# Altium schematic sheet Sheet_2.schdoc
size 291 x 189 mm
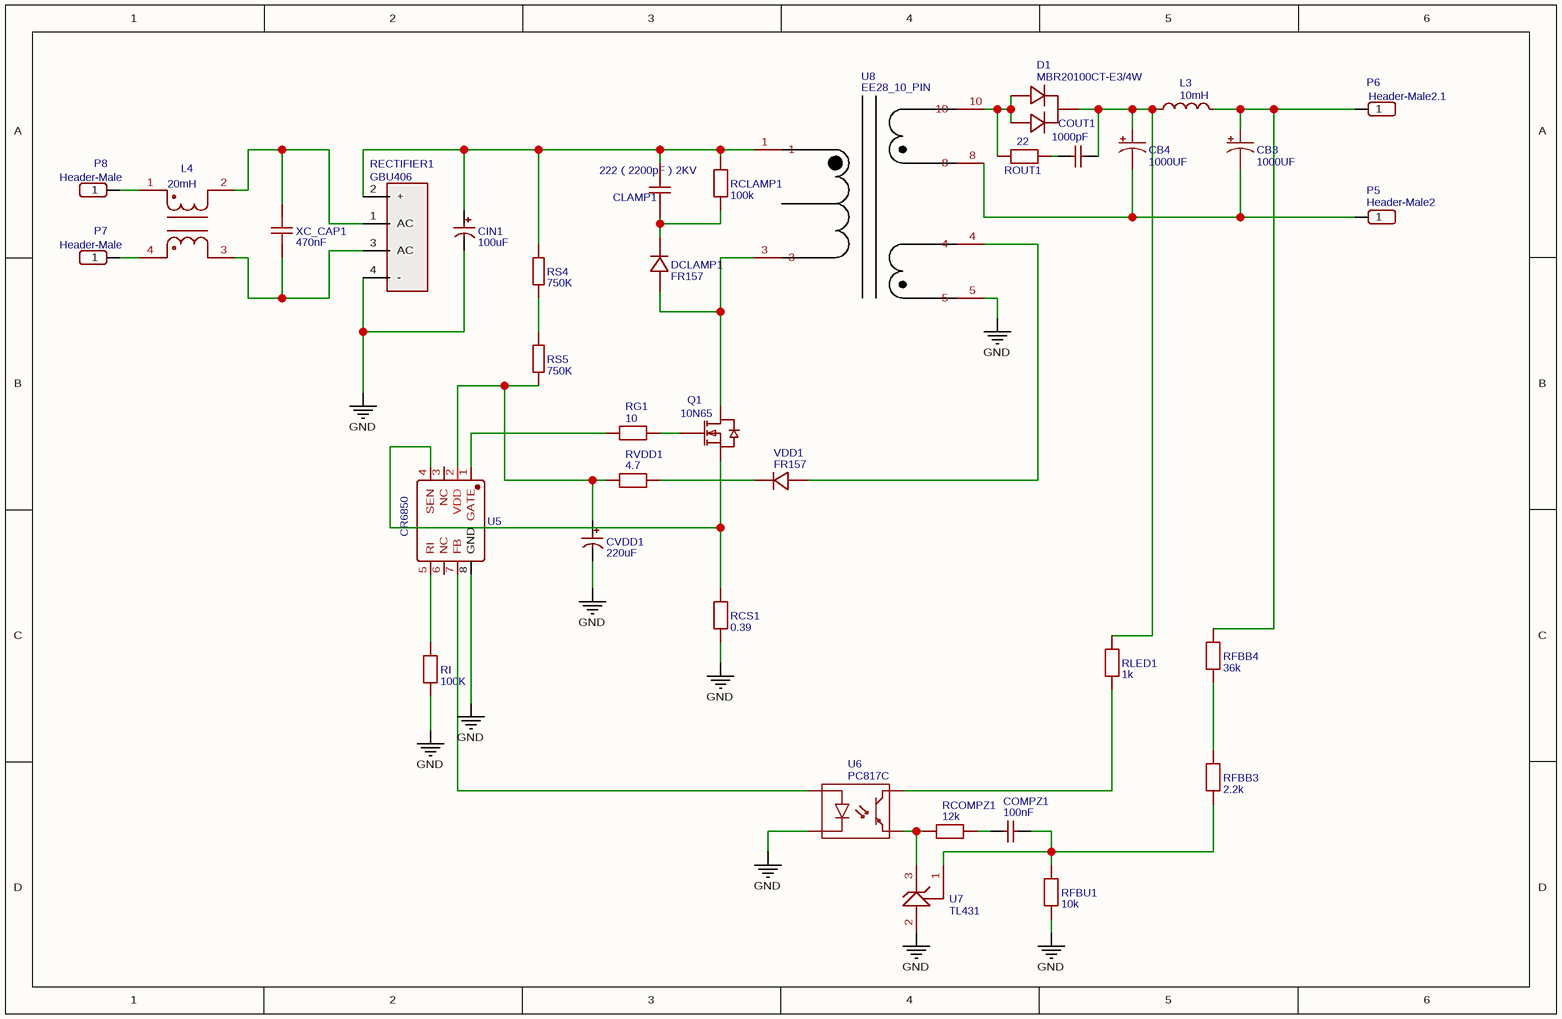
[diagram p0: Sheet_2.schdoc]

## Parts
CB3  1000UF  [CPOL-RADIAL-1000UF-25V-KIT]
CB4  1000UF  [CPOL-RADIAL-1000UF-25V-KIT]
CIN1  100uF  [CAP-TH_BD18.0-P7.50-D1.2-FD]
CLAMP1  222（2200pF）2KV  [CAP-TH_L5.0-W4.0-P5.00-D1.0-FD]
COMPZ1  100nF  [RAD-0.2]
COUT1  1000pF  [CAP-12*3-10MM]
CVDD1  220uF  [CAP-TH_BD8.0-P3.50-D1.0-FD]
D1  MBR20100CT-E3/4W  [TO-220AB(TO-220-3)]
DCLAMP1  FR157  [DO-15]
L3  10mH  [IND-TH_BD8.0-P3.00-D0.6]
L4  20mH  [FILTER-TH_4P-L17.0-W12.0-P7.00-D0.6-S8.00]
P5  Header-Male2  [HDR-1X1/2.54]
P6  Header-Male2.1  [HDR-1X1/2.54]
P7  Header-Male  [HDR-1X1/2.54]
P8  Header-Male  [HDR-1X1/2.54]
Q1  10N65  [TO-220F(TO-220IS)]
RCLAMP1  100k  [AXIAL-0.6]
RCOMPZ1  12k  [AXIAL-0.4]
RCS1  0.39  [AXIAL-0.8]
RECTIFIER1  GBU406  [BRIDGE-GBU]
RFBB3  2.2k  [AXIAL-0.4]
RFBB4  36k  [AXIAL-0.4]
RFBU1  10k  [AXIAL-0.4]
RG1  10  [AXIAL-0.3]
RI  100K  [AXIAL-0.4]
RLED1  1k  [AXIAL-0.4]
ROUT1  22  [AXIAL-0.4]
RS4  750K  [RES-TH_BD2.3-L6.5-P10.50-D0.5]
RS5  750K  [RES-TH_BD2.3-L6.5-P10.50-D0.5]
RVDD1  4.7  [AXIAL-0.4]
U5  CR6850  [DIP-8_L9.3-W6.4-P2.54-LS7.6-BL]
U6  PC817C  [DIP4]
U7  TL431  [TO-92(TO-92-3)]
U8  EE28_10_PIN  [TRANSFORMER_EE28_10PIN]
VDD1  FR157  [DO-15]
XC_CAP1  470nF  [CAP-SAFE-18.0*10.0]

## Nets
GND: CIN1.2 CVDD1.2 RCS1.1 RECTIFIER1.4(-) RFBU1.1 RI.1 U5.8(GND) U6.2(K) U7.2(ANODE) U8.5
NetCB3_+: CB3.+ L3.2 P6.1 RFBB4.2
NetCB3_-: CB3.- CB4.- P5.1 U8.8
NetCB4_+: CB4.+ COUT1.2 D1.2 L3.1 RLED1.2
NetCIN1_1: CIN1.1 CLAMP1.2 RCLAMP1.2 RECTIFIER1.2(+) RS4.2 U8.1
NetCLAMP1_1: CLAMP1.1 DCLAMP1.2(K) RCLAMP1.1
NetCOMPZ1_1: COMPZ1.1 RCOMPZ1.2
NetCOMPZ1_2: COMPZ1.2 RFBB3.1 RFBU1.2 U7.1(REF)
NetCOUT1_1: COUT1.1 ROUT1.2
NetCVDD1_1: CVDD1.1 RS5.1 RVDD1.1 U5.2(VDD)
NetD1_1: D1.1 D1.3 ROUT1.1 U8.10
NetDCLAMP1_1: DCLAMP1.1(A) Q1.2(D) U8.3
NetL4_1: L4.1 P8.1
NetL4_2: L4.2 RECTIFIER1.1(AC) XC_CAP1.1
NetL4_3: L4.3 RECTIFIER1.3(AC) XC_CAP1.2
NetL4_4: L4.4 P7.1
NetQ1_1: Q1.1(G) RG1.2
NetQ1_3: Q1.3(S) RCS1.2 U5.4(SEN)
NetRCOMPZ1_1: RCOMPZ1.1 U6.3(E) U7.3(CATHODE)
NetRFBB3_2: RFBB3.2 RFBB4.1
NetRG1_1: RG1.1 U5.1(GATE)
NetRI_2: RI.2 U5.5(RI)
NetRLED1_1: RLED1.1 U6.4(C)
NetRS4_1: RS4.1 RS5.2
NetRVDD1_2: RVDD1.2 VDD1.2(K)
NetU5_7: U5.7(FB) U6.1(A)
NetU8_4: U8.4 VDD1.1(A)

Not connected (* = marked no-connect by the designer): U5 3(NC) 6(NC)

## Library data of the parts
CB3 CB4 = 1000UF: description: CAP-08070; Contributor: SparkFun; spicePre: C
CIN1 = 100uF: BOM_Manufacturer: ValuePro; BOM_Manufacturer Part: 400V 100uF 18X30; nameAlias: Capacitance; BOM_Supplier: LCSC; BOM_Supplier Part: C2767; spicePre: C; spiceSymbolName: 400V 100uF 18X30
CLAMP1 = 222（2200pF）2KV: BOM_Manufacturer: ReliaPro; Value: 2.2nF; BOM_Supplier Part: C24926; BOM_Supplier: LCSC; BOM_Manufacturer Part: 222（2200pF）2KV; image: http://image.lceda.cn/szlcsc/C24926.jpg; spicePre: C
COMPZ1 = 100nF: BOM_Manufacturer: ReliaPro; BOM_Manufacturer Part: 104/100V 20%; nameAlias: Capacitance; BOM_Supplier: LCSC; BOM_Supplier Part: C26856; spicePre: C; spiceSymbolName: 104/100V 20%
COUT1 = 1000pF: BOM_Manufacturer: ReliaPro; BOM_Manufacturer Part: 102M 400V Y5V; nameAlias: Value; BOM_Supplier: LCSC; BOM_Supplier Part: C3704; spicePre: C; spiceSymbolName: 102M 400V Y5V
CVDD1 = 220uF: BOM_Manufacturer: ValuePro; BOM_Manufacturer Part: 220uf/35V; nameAlias: Capacitance; BOM_Supplier: LCSC; BOM_Supplier Part: C2063; spicePre: C; spiceSymbolName: 220uf/35V
D1 = MBR20100CT-E3/4W: BOM_Manufacturer: Vishay Intertech; Contributor: LCSC; BOM_Supplier: LCSC; BOM_Supplier Part: C222466; BOM_Manufacturer Part: MBR20100CT-E3/4W; spicePre: D
DCLAMP1 VDD1 = FR157: BOM_Manufacturer: MDD; BOM_Supplier: LCSC; BOM_Manufacturer Part: FR157; image: //image.lceda.cn/szlcsc/C2467.jpg; BOM_Supplier Part: C2467; spicePre: D
L3 = 10mH: BOM_Manufacturer: FH; BOM_Manufacturer Part: VLU0608-103K; nameAlias: Inductance; BOM_Supplier: LCSC; BOM_Supplier Part: C72613; spicePre: L; spiceSymbolName: VLU0608-103K
L4 = 20mH: BOM_Manufacturer: Guangdong Fenghua Advanced Tech; BOM_Manufacturer Part: UU9.8-10mH; nameAlias: Value; Contributor: LCSC; BOM_Supplier: LCSC; BOM_Supplier Part: C148474; spicePre: L; spiceSymbolName: UU9.8-10MH
P5 = Header-Male2: BOM_Manufacturer: ReliaPro; BOM_Manufacturer Part: Header-Male-2.54_1x1; BOM_Supplier: LCSC; BOM_Supplier Part: C81276; spicePre: P
P6 = Header-Male2.1: BOM_Manufacturer: ReliaPro; BOM_Manufacturer Part: Header-Male-2.54_1x1; BOM_Supplier: LCSC; BOM_Supplier Part: C81276; spicePre: P
P7 P8 = Header-Male: BOM_Manufacturer: ReliaPro; BOM_Manufacturer Part: Header-Male-2.54_1x1; BOM_Supplier: LCSC; BOM_Supplier Part: C81276; spicePre: P
Q1 = 10N65: BOM_Manufacturer: UTC; BOM_Manufacturer Part: 10N65KL-TF3-T; BOM_Supplier: LCSC; image: //image.lceda.cn/szlcsc/C74166.jpg; BOM_Supplier Part: C74166; spicePre: Q
RCLAMP1 = 100k: nameAlias: Value(Ω); spicePre: R; spiceSymbolName: Res_AXIAL-0.6(1W)_EU
RCOMPZ1 = 12k: nameAlias: Value(Ω); spicePre: R; spiceSymbolName: Res_AXIAL-0.4(1/4W)_EU
RCS1 = 0.39: nameAlias: Value(Ω); spicePre: R; spiceSymbolName: Res_AXIAL-0.8(2W)_EU
RECTIFIER1 = GBU406: BOM_Manufacturer: MDD; BOM_Manufacturer Part: GBU406 Rectifier bridge; BOM_Supplier: LCSC; image: //image.lceda.cn/szlcsc/C13432.jpg; BOM_Supplier Part: C13432; spicePre: D
RFBB3 = 2.2k: nameAlias: Value(Ω); spicePre: R; spiceSymbolName: Res_AXIAL-0.4(1/4W)_EU
RFBB4 = 36k: nameAlias: Value(Ω); spicePre: R; spiceSymbolName: Res_AXIAL-0.4(1/4W)_EU
RFBU1 = 10k: nameAlias: Value(Ω); spicePre: R; spiceSymbolName: Res_AXIAL-0.4(1/4W)_EU
RG1 = 10: nameAlias: Value(Ω); spicePre: R; spiceSymbolName: Res_AXIAL-0.3(1/8W)_EU
RI = 100K: nameAlias: Value(Ω); spicePre: R; spiceSymbolName: Res_AXIAL-0.4(1/4W)_EU
RLED1 = 1k: nameAlias: Value(Ω); spicePre: R; spiceSymbolName: Res_AXIAL-0.4(1/4W)_EU
ROUT1 = 22: nameAlias: Value(Ω); spicePre: R; spiceSymbolName: Res_AXIAL-0.4(1/4W)_EU
RS4 RS5 = 750K: BOM_Manufacturer: Chian Chia Elec; nameAlias: Resistance (Ohms); Contributor: LCSC; BOM_Supplier: LCSC; BOM_Supplier Part: C119386; BOM_Manufacturer Part: -; spicePre: R; spiceSymbolName: MF1/4W-750KΩ±1% T52
RVDD1 = 4.7: nameAlias: Value(Ω); spicePre: R; spiceSymbolName: Res_AXIAL-0.4(1/4W)_EU
U5 = CR6850: BOM_Manufacturer: Chip-Rail; BOM_Manufacturer Part: CR6850D; Contributor: LCSC; BOM_Supplier: LCSC; BOM_Supplier Part: C433346; spicePre: U; spiceSymbolName: CR6850D_C433346
U6 = PC817C: nameAlias: Model; sourceId: GMlVvHhfc; spicePre: X; model: PC817C; link: https://www.farnell.com/datasheets/73758.pdf; spiceSymbolName: PC817C
U7 = TL431: BOM_Manufacturer: TI; BOM_Manufacturer Part: TL431AILP; Contributor: LCSC; BOM_Supplier: LCSC; BOM_Supplier Part: C72108; spicePre: U
U8 = EE28_10_PIN: Contributor: kevwe; BOM_Manufacturer Part: EE28_10_PIN; BOM_Supplier Part: undefined; link: https://www.alldatasheet.com/datasheet-pdf/pdf/461251/NEC/FEE28S.html; spicePre: U
XC_CAP1 = 470nF: BOM_Manufacturer: Tongfeng; nameAlias: Capacitance; Contributor: LCSC; BOM_Supplier: LCSC; BOM_Supplier Part: C281974; BOM_Manufacturer Part: -; spicePre: C; spiceSymbolName: MKP-0.47uF275V ±10%